# EAGLE design Navi (EAGLE 7.5.0)
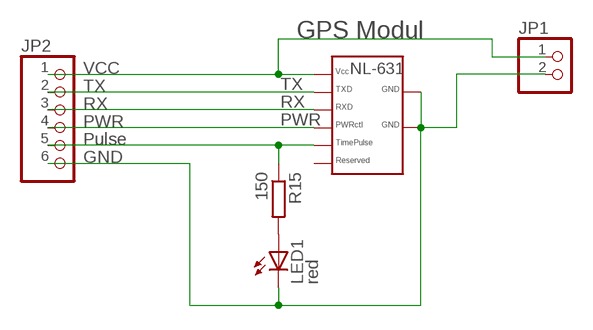
[diagram p0: schematic, sheet 1]

## Parts
JP1  PINHD-1X2  [1X02]
JP2  PINHD-1X6  [1X06]
LED1  red  LED3MM  [LED3MM]
R15  150  R-EU_R1206  [R1206]
U$2  NAVILOK-NL-631ETTL  [NAVILOK-NL-631ETTL]

## Nets
GND: JP1.2 JP2.6 LED1.K(C) U$2.P$7 U$2.P$8
N$17: JP1.1 JP2.1 U$2.P$1
N$32: JP2.5 R15.1 U$2.P$5
N$33: LED1.A R15.2
PWR: JP2.4 U$2.P$4
RX: JP2.3 U$2.P$3
TX: JP2.2 U$2.P$2
Unconnected: U$2.P$6

## Notes on the sheet
- GPS Modul
- VCC
- Pulse
- GND

## Library data of the parts
JP1 = pinhead:PINHD-1X2: PIN HEADER
JP2 = pinhead:PINHD-1X6: PIN HEADER
LED1 = led:LED: LED OSRAM: - CHIPLED LG R971, LG N971, LY N971, LG Q971, LY Q971, LO R971, LY R971 LH N974, LH R974 LS Q976, LO Q976, LY Q976 LO Q996 - Hyper CHIPLED LW Q18S LB Q993, LB Q99A, LB R99A - SideLED LS A670, LO A670, LY A670, LG A670, LP A670 LB A673, LV A673, LT A673, LW A673 LH A674 LY A675 LS A676, LA A676, LO A676, LY A676, LW A676 LS A679, LY A679, LG A679 - Hyper Micro SIDELED® LS Y876, LA Y876, LO Y876, LY Y876 LT Y87S - SmartLED LW L88C, LW L88S LB L89C, LB L89S, LG L890 LS L89K, LO L89K, LY L89K LS L896, LA L896, LO L896, LY L896 - TOPLED LS T670, LO T670, LY T670, LG T670, LP T670 LSG T670, LSP T670, LSY T670, LOP T670, LYG T670 LG T671, LOG T671, LSG T671 LB T673, LV T673, LT T673, LW T673 LH T674 LS T676, LA T676, LO T676, LY T676, LB T676, LH T676, LSB T676, LW T676 LB T67C, LV T67C, LT T67C, LS T67K, LO T67K, LY T67K, LW E67C LS E67B, LA E67B, LO E67B, LY E67B, LB E67C, LV E67C, LT E67C LW T67C LS T679, LY T679, LG T679 LS T770, LO T770, LY T770, LG T770, LP T770 LB T773, LV T773, LT T773, LW T773 LH T774 LS E675, LA E675, LY E675, LS T675 LS T776, LA T776, LO T776, LY T776, LB T776 LHGB T686 LT T68C, LB T68C - Hyper Mini TOPLED® LB M676 - Mini TOPLED Santana® LG M470 LS M47K, LO M47K, LY M47K Source: http://www.osram.convergy.de LUXEON: - LUMILED® LXK2-PW12-R00, LXK2-PW12-S00, LXK2-PW14-U00, LXK2-PW14-V00 LXK2-PM12-R00, LXK2-PM12-S00, LXK2-PM14-U00 LXK2-PE12-Q00, LXK2-PE12-R00, LXK2-PE12-S00, LXK2-PE14-T00, LXK2-PE14-U00 LXK2-PB12-K00, LXK2-PB12-L00, LXK2-PB12-M00, LXK2-PB14-N00, LXK2-PB14-P00, LXK2-PB14-Q00 LXK2-PR12-L00, LXK2-PR12-M00, LXK2-PR14-Q00, LXK2-PR14-R00 LXK2-PD12-Q00, LXK2-PD12-R00, LXK2-PD12-S00 LXK2-PH12-R00, LXK2-PH12-S00 LXK2-PL12-P00, LXK2-PL12-Q00, LXK2-PL12-R00 Source: www.luxeon.com KINGBRIGHT: KA-3528ASYC Source: www.kingbright.com
R15 = resistor:R-EU_: RESISTOR, European symbol
U$2 = 0liver:NAVILOK-NL-631ETTL

## Board
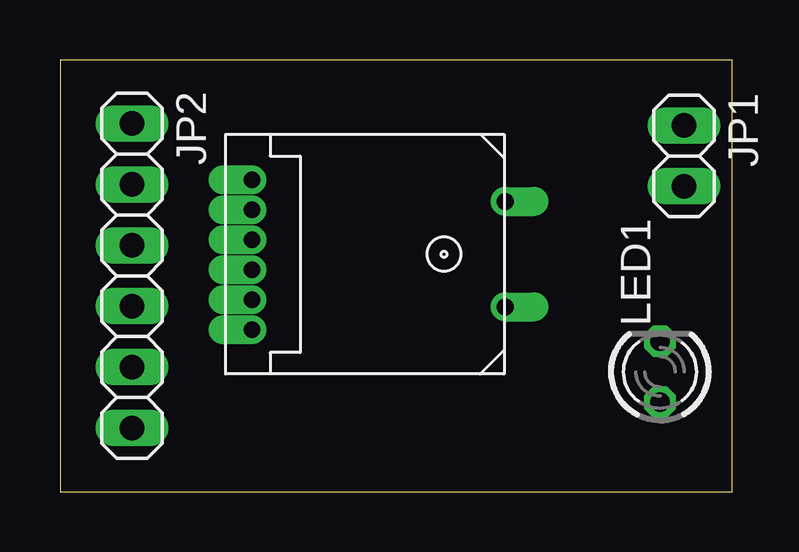
[diagram p1: board, top side]
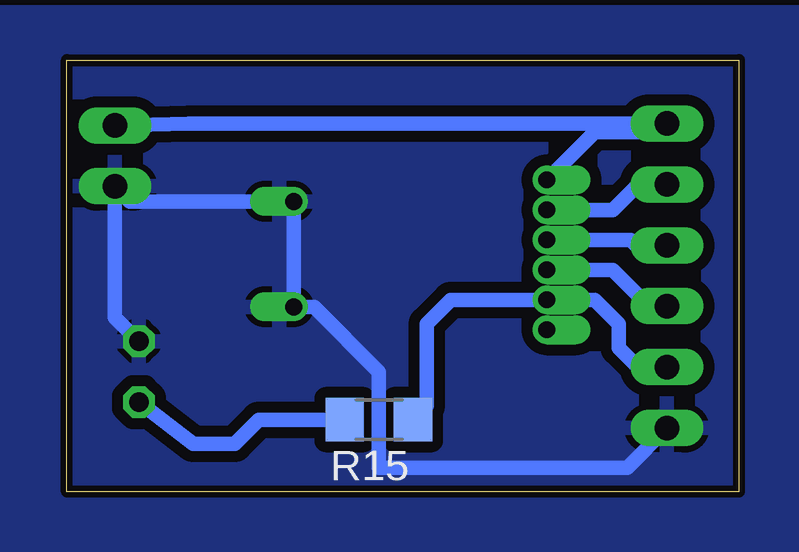
[diagram p2: board, bottom side, seen from below]

Size 28 x 18 mm. Coordinates in mm from the lower left corner, seen from the top.
Outline: 0,0 28,0 28,18 0,18 0,0
Copper layers (1*16): Top 0.035mm / dielectric 1.5mm / Bottom 0.035mm
Design rules "default *": minimum track width 10mil, minimum drill 24mil, track to track 18mil, track to pad 18mil, pad to pad 18mil, via to via 18mil, smd to smd 8mil, copper to edge 10mil, drill to drill 8mil, minimum pad ring 10mil, minimum via ring 8mil, stop-mask expansion 4mil, vias tented up to drill 0mil, thermal gap 10mil

### Footprints (pad centres in the part's own frame; a part is rotated, then mirrored left to right if it is on the bottom)
1X02 = drill 1.016 long: 1 -1.27,0; 2 1.27,0
1X06 = drill 1.016 long: 1 -6.35,0; 2 -3.81,0; 3 -1.27,0; 4 1.27,0; 5 3.81,0; 6 6.35,0
LED3MM = drill 0.813 octagon: A -1.27,0; K 1.27,0
R1206 = smd 1.6 x 1.803: 1 -1.422,0; 2 1.422,0
NAVILOK-NL-631ETTL = drill 0.7 pad 0.813 offset: P$1 0,0; P$2 1.25,0; P$3 2.5,0; P$4 3.75,0; P$5 5,0; P$6 6.25,0 | drill 0.7 pad 1.016 offset: P$7 0.9,10.55; P$8 5.3,10.55

### Placement (x,y rotation side)
JP1  26,14 270 top
JP2  3,9 270 top
LED1  25,5 90 top
R15  15,3 180 bottom
U$2  8,13 270 top

### Tracks (layer width: path | path; a pad name or v marks a point on that pad's centre or on a via)
GND
  Bottom 0.61: JP2.6 4.65,1 15,1 15,5 17.7,7.7 U$2.P$8 U$2.P$7 25.37,12.1 JP1.2 26,7.27 LED1.K
  pour Bottom: -1,19 -1,-2 30,-2 30,19
N$1
  pour Bottom: -3,20 32,20 32,-3 -3,-3
N$17
  Bottom 0.61: U$2.P$1 6,15 3.35,15 JP2.1 22.92,15.35 JP1.1
N$32
  Bottom 0.61: JP2.5 3.19,5 4,5 5,6 5,7 6,8 U$2.P$5 12,8 13,7 13,3.58 R15.1
N$33
  Bottom 0.61: R15.2 20,3 21,2 22.73,2 LED1.A
PWR
  Bottom 0.61: U$2.P$4 5.25,9.25 4,8 3.27,8 JP2.4
RX
  Bottom 0.61: U$2.P$3 4.5,10.5 4,10 3.27,10 JP2.3
TX
  Bottom 0.61: JP2.2 4.19,12.81 5.25,11.75 U$2.P$2